# EAGLE schematic HBridgeModel (EAGLE 9.0.0)
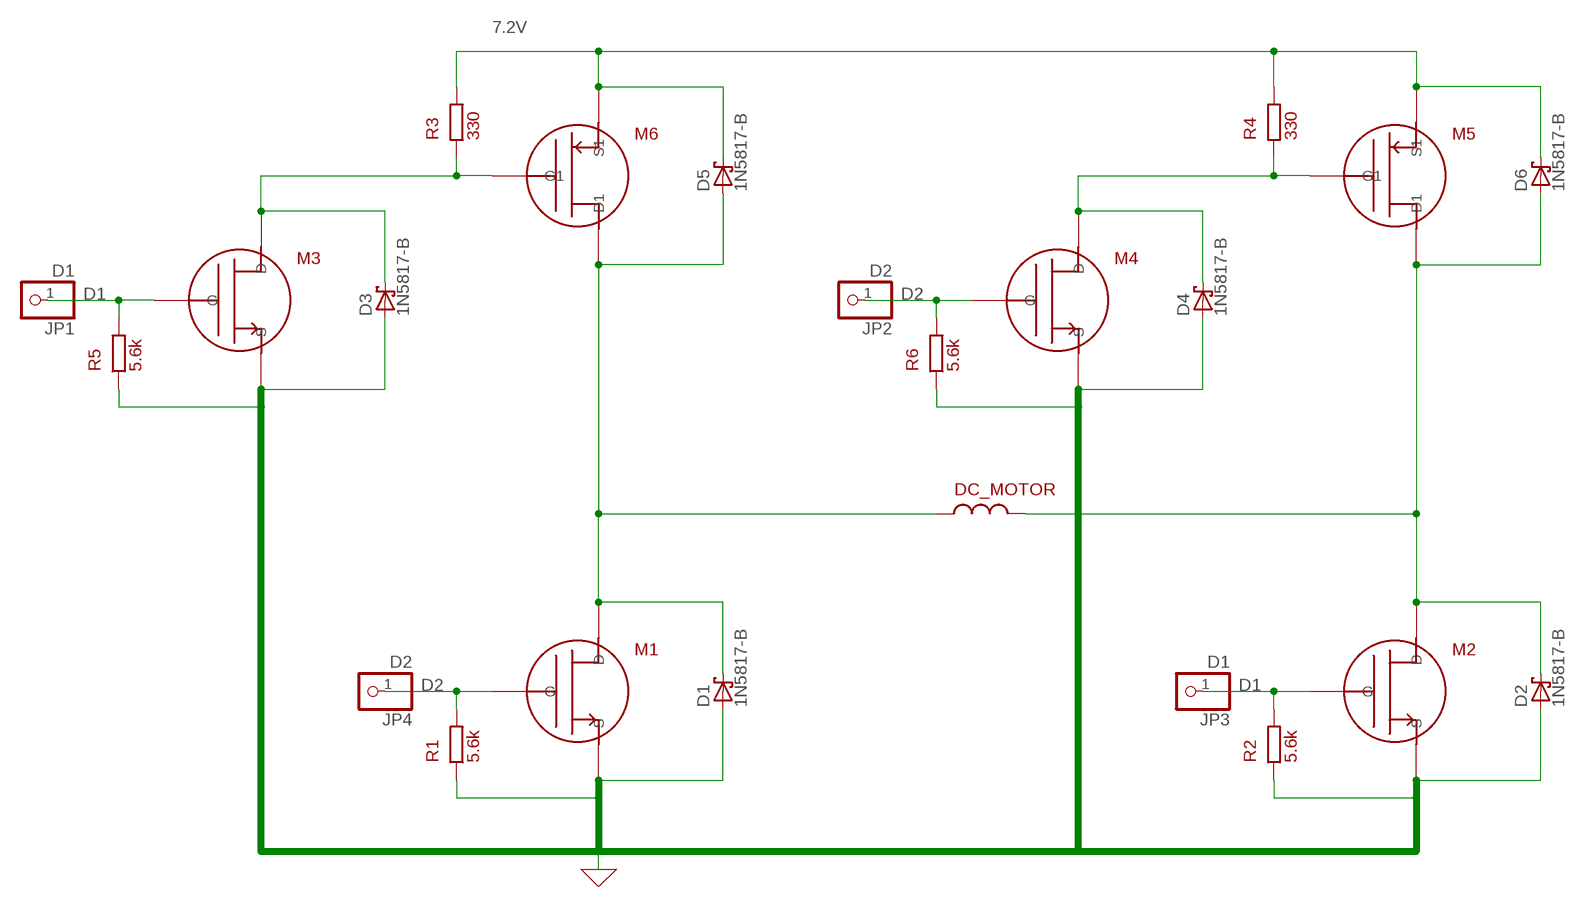
[diagram p0: schematic, sheet 1]

## Parts
D1  1N5817-B  [DO41-7.6]
D2  1N5817-B  [DO41-7.6]
D3  1N5817-B  [DO41-7.6]
D4  1N5817-B  [DO41-7.6]
D5  1N5817-B  [DO41-7.6]
D6  1N5817-B  [DO41-7.6]
DC_MOTOR  L  (no package)
JP1  D1  PINHD-1X1  [1X01]
JP2  D2  PINHD-1X1  [1X01]
JP3  D1  PINHD-1X1  [1X01]
JP4  D2  PINHD-1X1  [1X01]
M1  FET_N  (no package)
M2  FET_N  (no package)
M3  FET_N  (no package)
M4  FET_N  (no package)
M5  FET_P  (no package)
M6  FET_P  (no package)
R1  5.6k  R  (no package)
R2  5.6k  R  (no package)
R3  330  R  (no package)
R4  330  R  (no package)
R5  5.6k  R  (no package)
R6  5.6k  R  (no package)

## Nets
0: D1.A D2.A D3.A D4.A M1.S M2.S M3.S M4.S R1.1 R2.1 R5.1 R6.1 ; supply symbol labelled GND
7.2V: D5.C D6.C M5.S1 M6.S1 R3.2 R4.2
D1: JP1.1 JP3.1 M2.G M3.G R2.2 R5.2
D2: JP2.1 JP4.1 M1.G M4.G R1.2 R6.2
N$4: D1.C D5.A DC_MOTOR.1 M1.D M6.D1
N$5: D2.C D6.A DC_MOTOR.2 M2.D M5.D1
N$6: D3.C M3.D M6.G1 R3.1
N$7: D4.C M4.D M5.G1 R4.1

## Library data of the parts
D1-D6 = diode:1N581*: 1.0A SCHOTTKY BARRIER RECTIFIER Source: http://www.diodes.com/datasheets/ds23001.pdf
DC_MOTOR = ngspice-simulation:L: INDUCTOR
JP1-JP4 = pinhead:PINHD-1X1: PIN HEADER
M1-M4 = ngspice-simulation:FET_N: N-Type MOS Field Effect Transistor (MOSFET)
M5 M6 = ngspice-simulation:FET_P: P-Type MOS Field Effect Transistor (MOSFET)
R1-R6 = ngspice-simulation:R: RESISTOR